# EAGLE design ps2_to_db9_double (EAGLE 9.6.2)
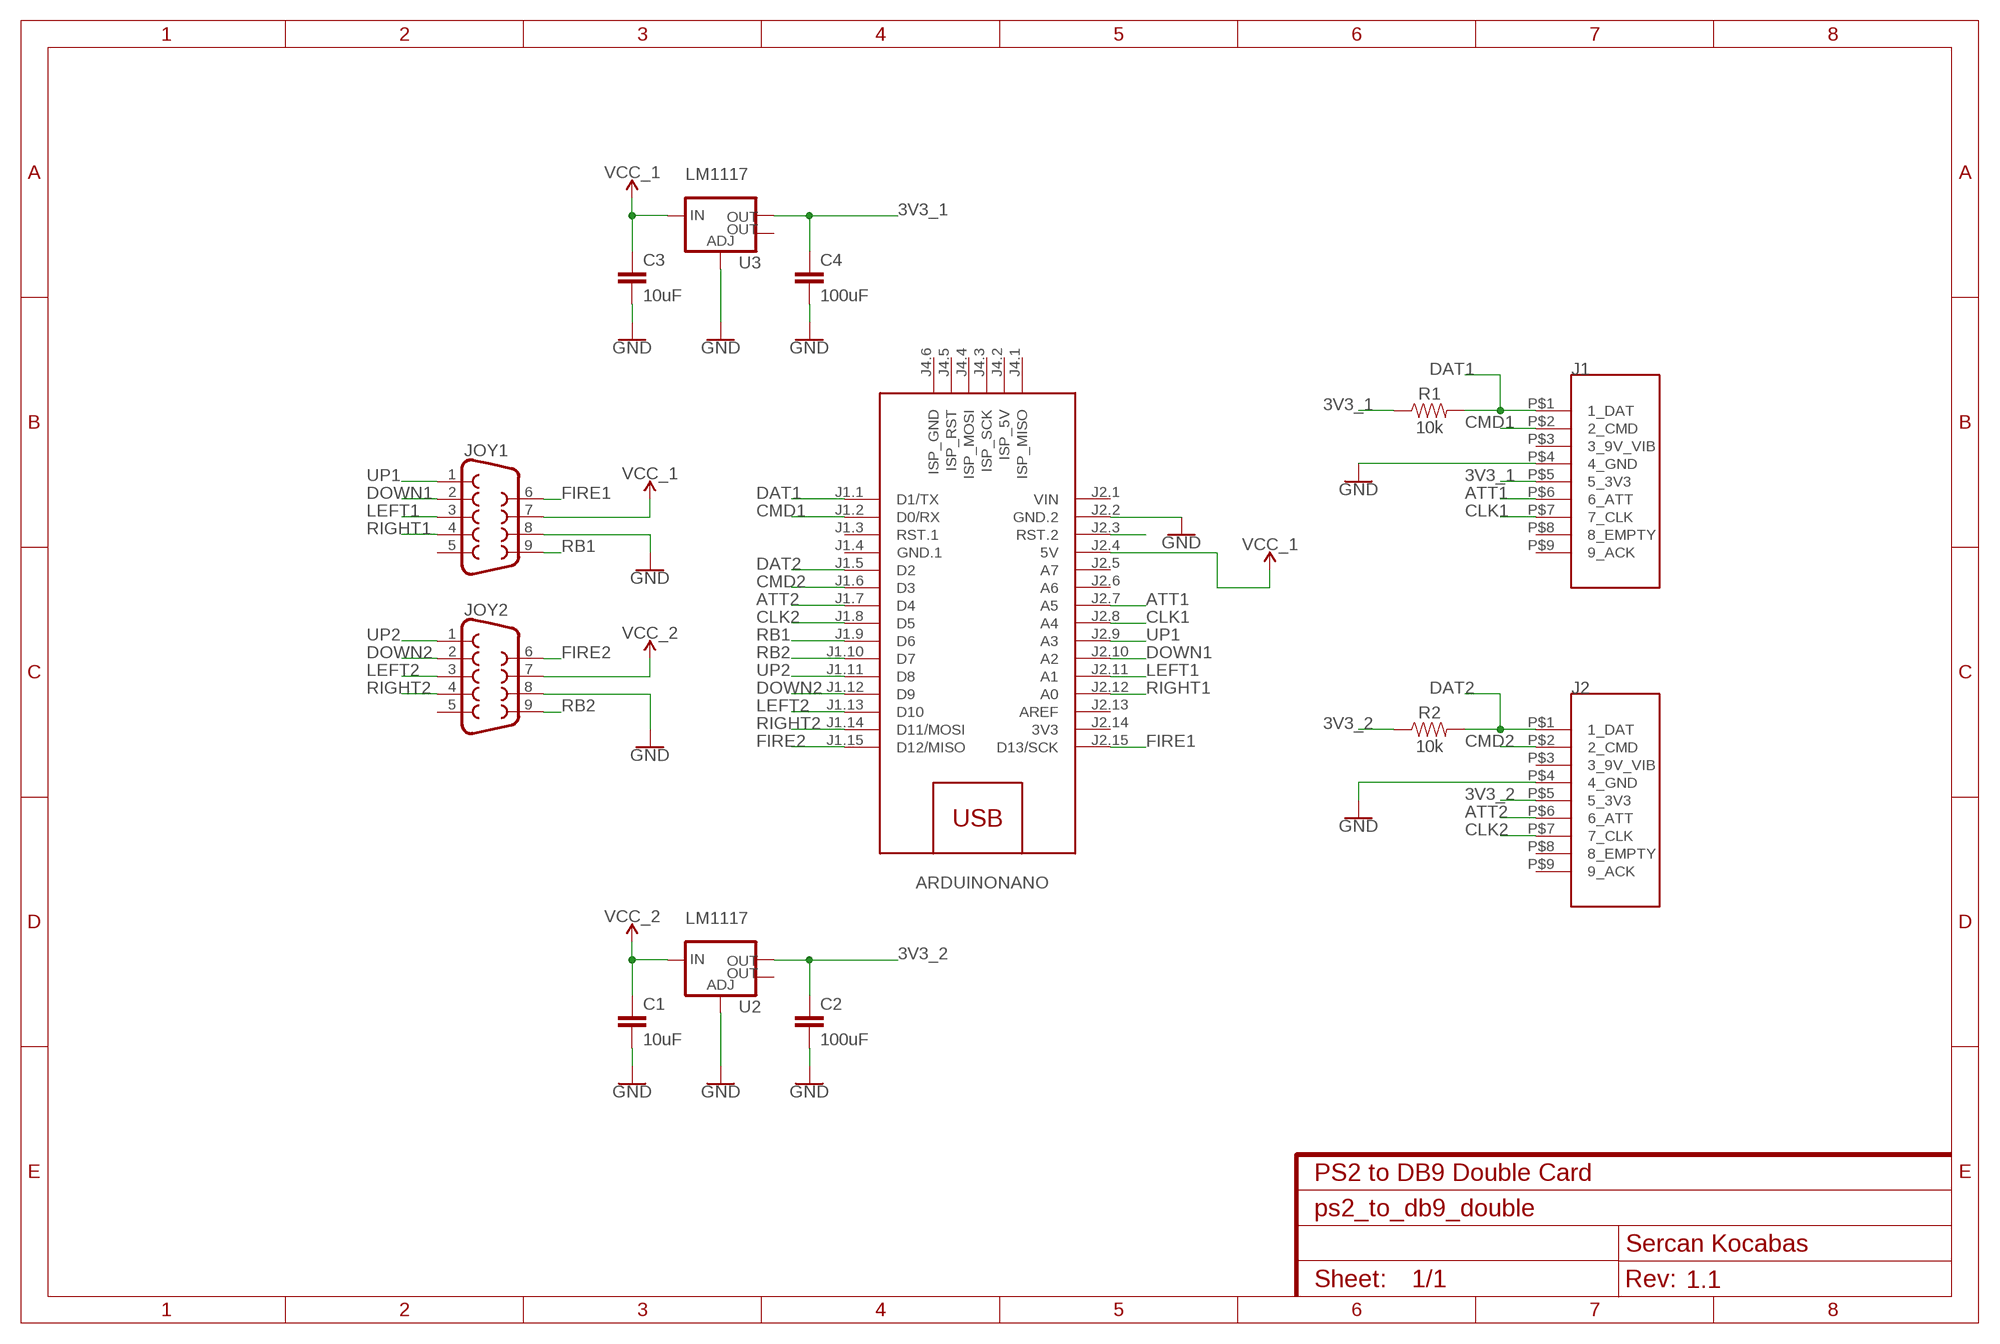
[diagram p0: schematic, sheet 1]
FRAME1 (FRAME-A4L): CNAME: PS2 to DB9 Double Card; CREVISION: 1.1; DESIGNER: Sercan Kocabas

## Parts
ARDUINONANO  ARDUINO-NANO-3.0#ISP  [ARDUINO-NANO-3.0#ISP]
C1  10uF  C-EU025-025X050  [C025-025X050]
C2  100uF  C-EU025-025X050  [C025-025X050]
C3  10uF  C-EU025-025X050  [C025-025X050]
C4  100uF  C-EU025-025X050  [C025-025X050]
J1  PS2_DUALSHOCK_UP  [PS2_DUALSHOCK_UP]
J2  PS2_DUALSHOCK_UP  [PS2_DUALSHOCK_UP]
JOY1  DB9FEMALE  [DB9]
JOY2  DB9FEMALE  [DB9]
R1  10k  10OHM-HORIZ-1/4W-1%  [AXIAL-0.3]
R2  10k  10OHM-HORIZ-1/4W-1%  [AXIAL-0.3]
U2  LM1117  V_REG_LM1117SOT223  [SOT223]
U3  LM1117  V_REG_LM1117SOT223  [SOT223]

## Nets
3V3_1: C4.1 J1.P$5(5_3V3) R1.P$1 U3.2(OUT)
3V3_2: C2.1 J2.P$5(5_3V3) R2.P$1 U2.2(OUT)
ATT1: ARDUINONANO.J2.7(A5) J1.P$6(6_ATT)
ATT2: ARDUINONANO.J1.7(D4) J2.P$6(6_ATT)
CLK1: ARDUINONANO.J2.8(A4) J1.P$7(7_CLK)
CLK2: ARDUINONANO.J1.8(D5) J2.P$7(7_CLK)
CMD1: ARDUINONANO.J1.2(D0/RX) J1.P$2(2_CMD)
CMD2: ARDUINONANO.J1.6(D3) J2.P$2(2_CMD)
DAT1: ARDUINONANO.J1.1(D1/TX) J1.P$1(1_DAT) R1.P$2
DAT2: ARDUINONANO.J1.5(D2) J2.P$1(1_DAT) R2.P$2
DOWN1: ARDUINONANO.J2.10(A2) JOY1.2
DOWN2: ARDUINONANO.J1.12(D9) JOY2.2
FIRE1: ARDUINONANO.J2.15(D13/SCK) JOY1.6
FIRE2: ARDUINONANO.J1.15(D12/MISO) JOY2.6
GND: ARDUINONANO.J2.2(GND.2) C1.2 C2.2 C3.2 C4.2 J1.P$4(4_GND) J2.P$4(4_GND) JOY1.8 JOY2.8 U2.1(ADJ) U3.1(ADJ)
LEFT1: ARDUINONANO.J2.11(A1) JOY1.3
LEFT2: ARDUINONANO.J1.13(D10) JOY2.3
N$24: ARDUINONANO.J2.3(RST.2)
RB1: ARDUINONANO.J1.9(D6) JOY1.9
RB2: ARDUINONANO.J1.10(D7) JOY2.9
RIGHT1: ARDUINONANO.J2.12(A0) JOY1.4
RIGHT2: ARDUINONANO.J1.14(D11/MOSI) JOY2.4
UP1: ARDUINONANO.J2.9(A3) JOY1.1
UP2: ARDUINONANO.J1.11(D8) JOY2.1
VCC_1: ARDUINONANO.J2.4(5V) C3.1 JOY1.7 U3.3(IN)
VCC_2: C1.1 JOY2.7 U2.3(IN)
Unconnected: ARDUINONANO.J1.3(RST.1) ARDUINONANO.J2.5(A7) ARDUINONANO.J2.6(A6) ARDUINONANO.J2.13(AREF) ARDUINONANO.J4.1(ISP_MISO) ARDUINONANO.J4.2(ISP_5V) ARDUINONANO.J4.3(ISP_SCK) ARDUINONANO.J4.4(ISP_MOSI) ARDUINONANO.J4.5(ISP_RST) ARDUINONANO.J4.6(ISP_GND) J1.P$3(3_9V_VIB) J1.P$8(8_EMPTY) J1.P$9(9_ACK) J2.P$3(3_9V_VIB) J2.P$8(8_EMPTY) J2.P$9(9_ACK) JOY1.5 JOY2.5 U2.4(OUT) U3.4(OUT)

## Power pins joined to a net without a drawn wire
3V3: ARDUINONANO.J2.14(3V3)
GND.1: ARDUINONANO.J1.4(GND.1)
VIN: ARDUINONANO.J2.1(VIN)

## Library data of the parts
ARDUINONANO = diy-modules:ARDUINO-NANO-3.0#ISP: Arduino Nano 3.0 (and compatible devices) with ISP pads More details available here: https://www.arduino.cc/en/Main/ArduinoBoardNano Click here to find device on ebay.com <http://www.ebay.com/sch/arduino+nano>
C1-C4 = rcl:C-EU: CAPACITOR, European symbol; SPICEPREFIX: C
J1 J2 = seco_lib:PS2_DUALSHOCK_UP
JOY1 JOY2 = SparkFun-Connectors:DB9: DB9 Connector Standard DB9 (D-Sub 9) serial connector. Can be used for CAN bus as well as RS485 and RS232. Footprint production proven. Here is the female version connector we sell at SparkFun: 9 Pin Female Serial Connector - PCB Mount <https://www.sparkfun.com/products/429> (PRT-00429) This connector has been used on the following SparkFun products: SparkFun RS232 Shifter - SMD <https://www.sparkfun.com/products/449> (PRT-00449) SparkFun RS232 Shifter SMD (No DB9) <https://www.sparkfun.com/products/8780> (PRT-08780); PROD_ID: CONN-08194
R1 R2 = SparkFun-Resistors:10OHM: 10Ω resistor A resistor is a passive two-terminal electrical component that implements electrical resistance as a circuit element. Resistors act to reduce current flow, and, at the same time, act to lower voltage levels within circuits. - Wikipedia; PROD_ID: RES-12180; VALUE: 10
U2 U3 = SparkFun-IC-Power:V_REG_LM1117: Voltage Regulator LM1117 Standard adjustable voltage regulator but in SMD form. Spark Fun Electronics SKU : COM-00595; PROD_ID: VREG-08170

## Board
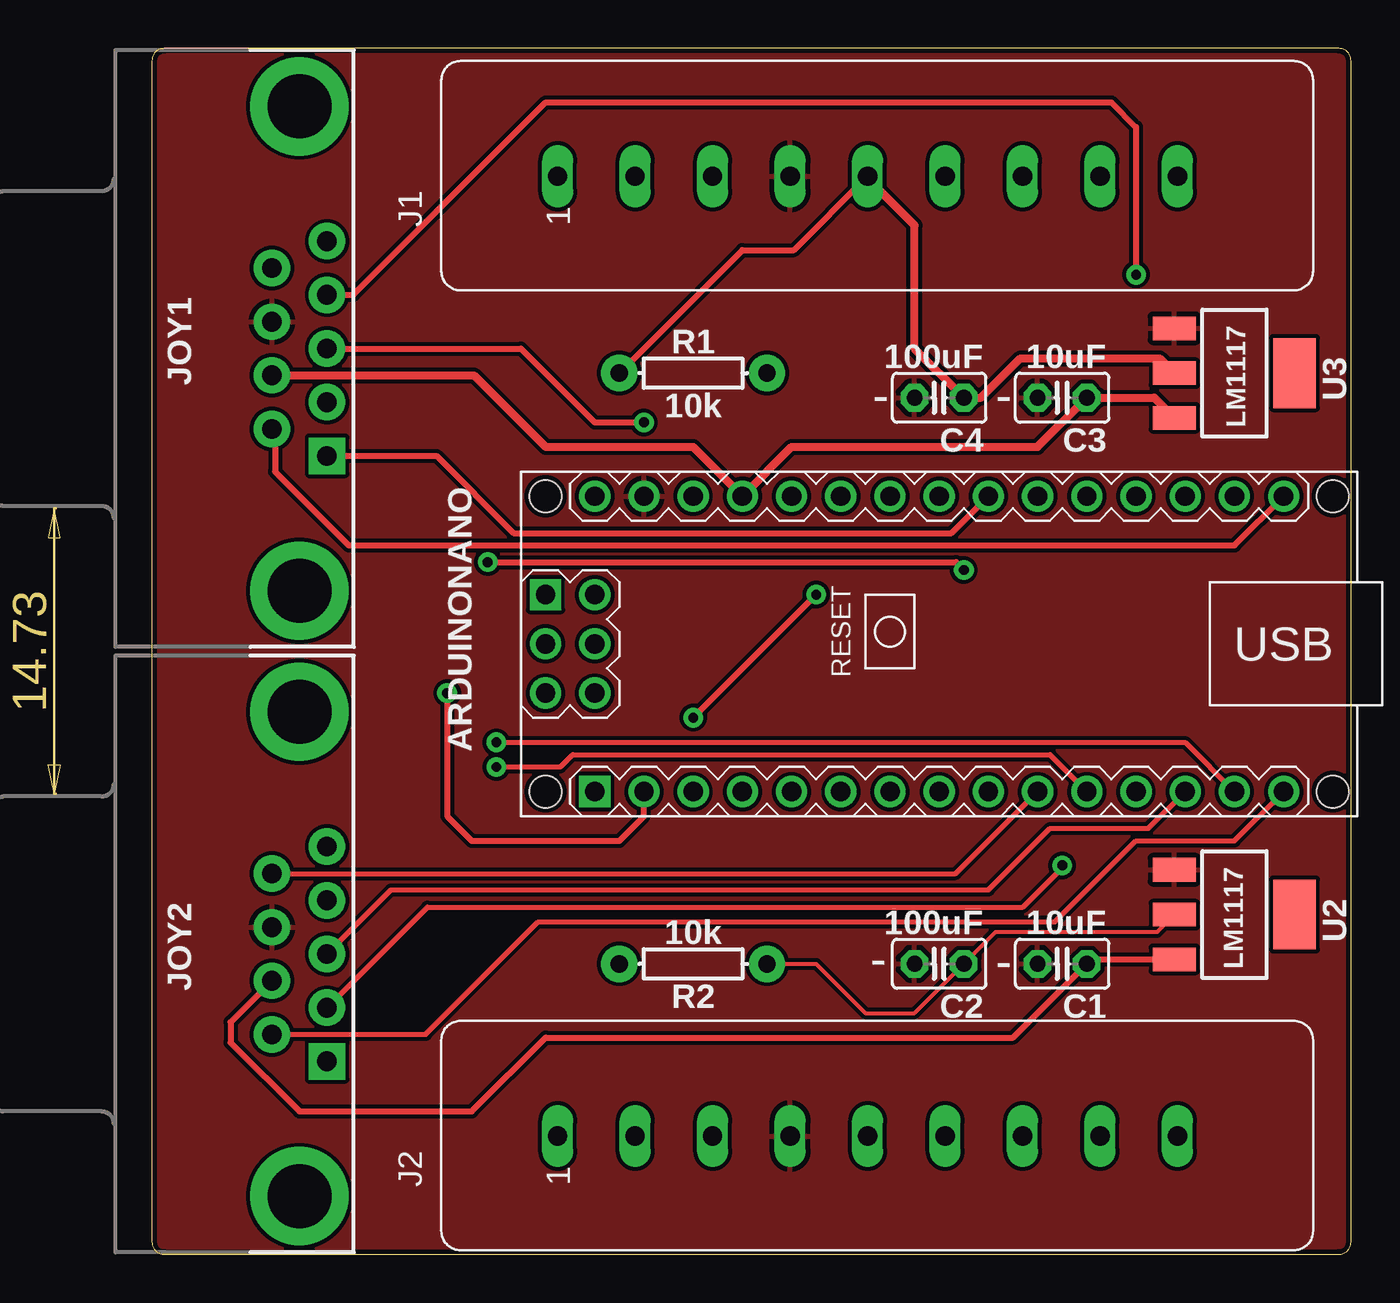
[diagram p1: board, top side]
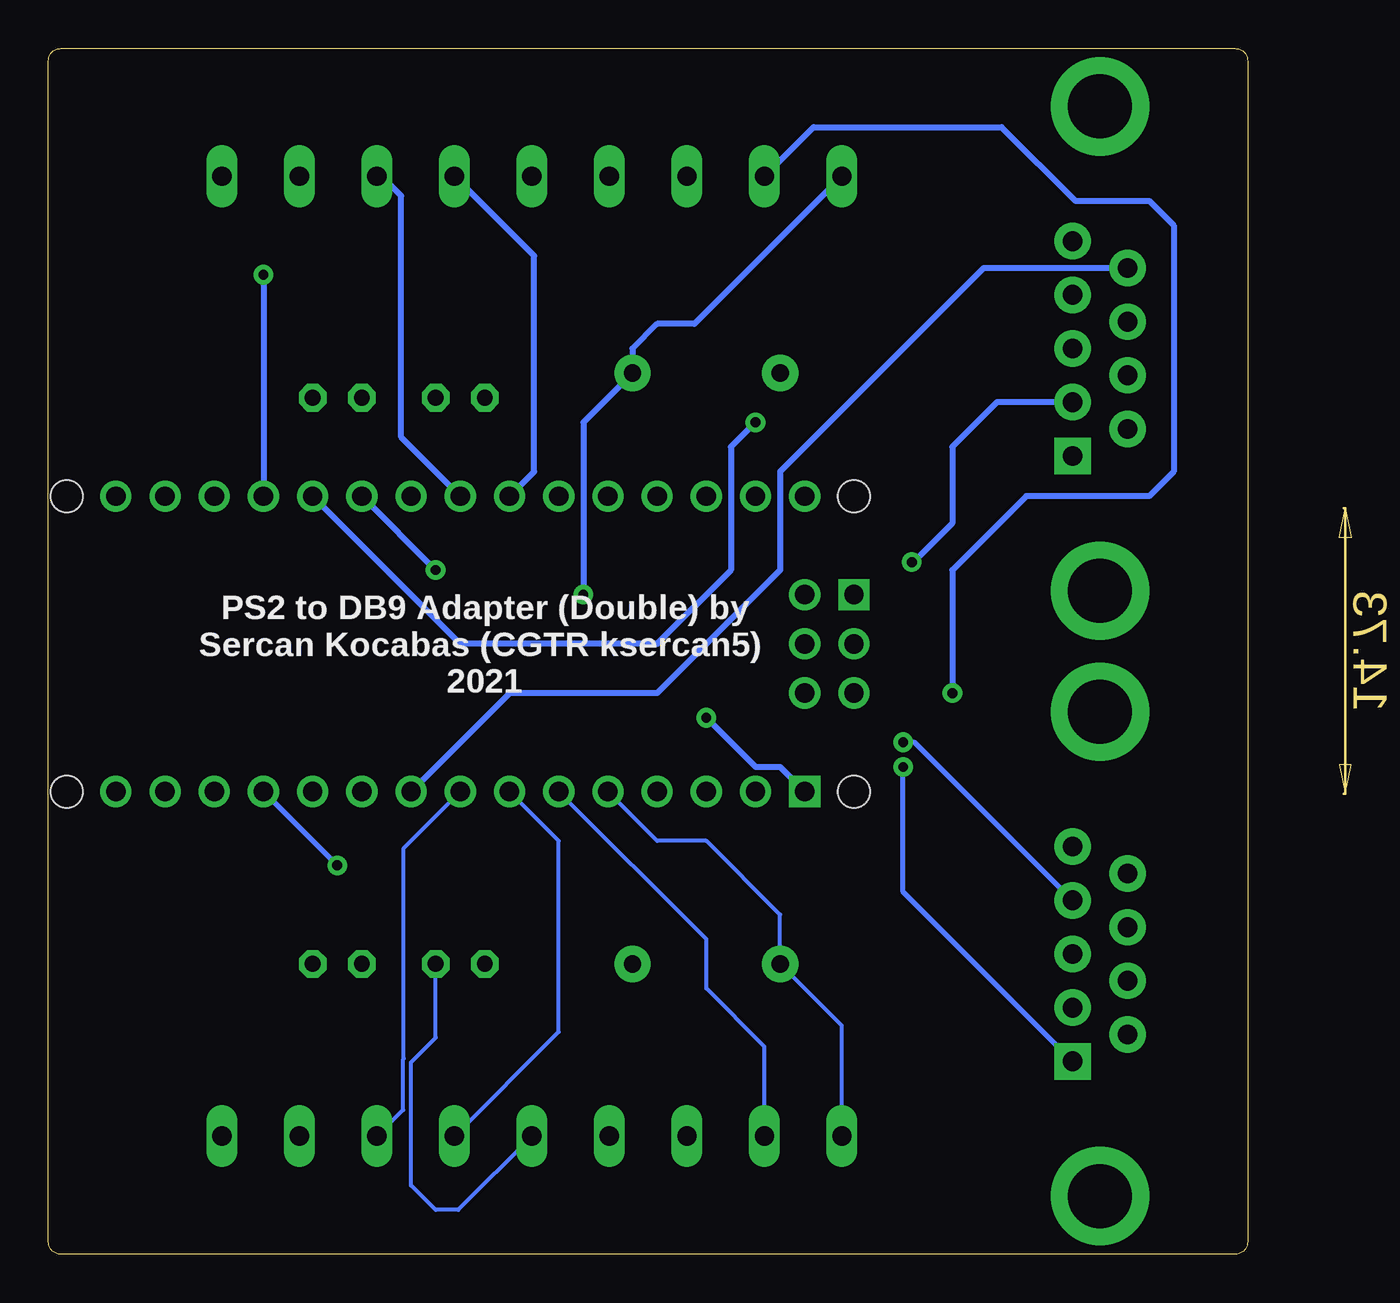
[diagram p2: board, bottom side, seen from below]

Size 61.9 x 62.22 mm. Coordinates in mm from the lower left corner, seen from the top.
Outline: 61.27,62.22 0.63,62.22 arc90 0,61.59 0,0.64 arc90 0.63,0 61.27,0 arc90 61.9,0.64 61.9,61.59 arc90 61.27,62.22
Copper layers (1*16): Top 0.035mm / dielectric 1.5mm / Bottom 0.035mm
Design rules "SparkFun": minimum track width 8mil, minimum drill 20mil, track to track 8mil, track to pad 8mil, pad to pad 8mil, via to via 8mil, smd to smd 8mil, copper to edge 10mil, drill to drill 8mil, minimum pad ring 12mil, minimum via ring 10mil, stop-mask expansion 4mil, vias tented up to drill 25mil, thermal gap 10mil

### Footprints (pad centres in the part's own frame; a part is rotated, then mirrored left to right if it is on the bottom)
ARDUINO-NANO-3.0#ISP = drill 1 square: J1.1 17.78,7.62; J4.1 20.32,-2.54 | drill 1: J1.2 15.24,7.62; J1.3 12.7,7.62; J1.4 10.16,7.62; J1.5 7.62,7.62; J1.6 5.08,7.62; J1.7 2.54,7.62; J1.8 0,7.62; J1.9 -2.54,7.62; J1.10 -5.08,7.62; J1.11 -7.62,7.62; J1.12 -10.16,7.62; J1.13 -12.7,7.62; J1.14 -15.24,7.62; J1.15 -17.78,7.62; J2.1 17.78,-7.62; J2.2 15.24,-7.62; J2.3 12.7,-7.62; J2.4 10.16,-7.62; J2.5 7.62,-7.62; J2.6 5.08,-7.62; J2.7 2.54,-7.62; J2.8 0,-7.62; J2.9 -2.54,-7.62; J2.10 -5.08,-7.62; J2.11 -7.62,-7.62; J2.12 -10.16,-7.62; J2.13 -12.7,-7.62; J2.14 -15.24,-7.62; J2.15 -17.78,-7.62; J4.2 17.78,-2.54; J4.3 20.32,0; J4.4 17.78,0; J4.5 20.32,2.54; J4.6 17.78,2.54 | hole 1.651: -20.32,7.62; -20.32,-7.62; 20.32,-7.62; 20.32,7.62
C025-025X050 = drill 0.813 octagon: 1 -1.27,0; 2 1.27,0
PS2_DUALSHOCK_UP = drill 1 long: P$1 0,7; P$2 0,3; P$3 0,-1; P$4 0,-5; P$5 0,-9; P$6 0,-13; P$7 0,-17; P$8 0,-21; P$9 0,-25
DB9 = drill 1.016 pad 1.88 square: 1 -5.54,-1.42 | drill 1.016 pad 1.88: 2 -2.77,-1.42; 3 0,-1.42; 4 2.77,-1.42; 5 5.54,-1.42; 6 -4.15,1.42; 7 -1.38,1.42; 8 1.38,1.42; 9 4.15,1.42 | drill 3.302 pad 5.08: G1 -12.5,0; G2 12.5,0
AXIAL-0.3 = drill 0.9 pad 1.88: P$1 -3.81,0; P$2 3.81,0
SOT223 = smd 1.219 x 2.235: 1 -2.311,-3.099; 2 0,-3.099; 3 2.311,-3.099 | smd 3.6 x 2.2: 4 0,3.099

### Placement (x,y rotation side)
ARDUINONANO  40.64,31.5 180 top
C1  46.99,14.99 180 top
C2  40.64,14.99 180 top
C3  46.99,44.2 180 top
C4  40.64,44.2 180 top
J1  27.94,55.63 90 top
J2  27.94,6.1 90 top
JOY1  7.62,46.74 90 top
JOY2  7.62,15.49 90 top
R1  27.94,45.47 0 top
R2  27.94,14.99 180 top
U2  55.88,17.53 270 top
U3  55.88,45.47 270 top

### Tracks (layer width: path | path; a pad name or v marks a point on that pad's centre or on a via)
3V3_1
  Top 0.305: R1.P$1 30.48,51.82 33.13,51.82 36.88,55.57 J1.P$5
  Top 0.406: U3.2 52.02,46.23 44.83,46.23 42.8,44.2 C4.1 39.37,46.74 39.37,53.09 36.88,55.57
3V3_2
  Top 0.203: R2.P$1 34.29,14.99 36.83,12.45 39.37,12.45 C2.1 43.56,16.64 51.89,16.64 U2.2
  Bottom 0.203: J2.P$5 40.75,2.29 41.91,2.29 43.18,3.56 43.18,9.91 41.91,11.18 C2.1
ATT1
  Bottom 0.305: ARDUINONANO.J2.7 36.83,40.39 36.83,51.52 J1.P$6
ATT2
  Bottom 0.203: J2.P$6 35.56,11.48 35.56,21.34 ARDUINONANO.J1.7
CLK1
  Bottom 0.305: ARDUINONANO.J2.8 43.69,42.16 43.69,54.61 44.7,55.63 J1.P$7
CLK2
  Bottom 0.203: J2.P$7 43.59,7.45 43.59,10.07 43.56,10.1 43.56,20.96 ARDUINONANO.J1.8
CMD1  (via drill 0.51)
  Top 0.305: v15.24,28.96 15.24,22.61 16.51,21.34 24.13,21.34 25.4,22.61 ARDUINONANO.J1.2
  Bottom 0.305: J1.P$2 22.4,58.17 12.7,58.17 8.89,54.36 5.08,54.36 3.81,53.09 3.81,40.39 5.08,39.12 11.43,39.12 15.24,35.31 v15.24,28.96
CMD2
  Bottom 0.203: J2.P$2 24.94,10.72 27.94,13.72 27.94,16.26 ARDUINONANO.J1.6
DAT1  (via drill 0.51)
  Top 0.305: v34.29,34.04 v27.94,27.69
  Bottom 0.305: J1.P$1 28.56,48.01 30.48,48.01 31.75,46.74 R1.P$2 34.29,42.93 v34.29,34.04 | v27.94,27.69 25.4,25.15 24.13,25.15 ARDUINONANO.J1.1
DAT2
  Bottom 0.203: ARDUINONANO.J1.5 30.48,21.34 27.94,21.34 24.13,17.53 R2.P$2 20.94,11.8 J2.P$1
DOWN1  (via drill 0.51)
  Top 0.305: v17.34,35.71 41.5,35.71 v41.91,35.31
  Bottom 0.305: JOY1.2 12.93,43.97 15.24,41.66 15.24,37.72 17.27,35.69 17.31,35.69 v17.34,35.71 | v41.91,35.31 ARDUINONANO.J2.10
DOWN2  (via drill 0.51)
  Top 0.254: JOY2.2 14.22,17.91 44.96,17.91 46.99,19.94 v46.99,20.07
  Bottom 0.254: v46.99,20.07 ARDUINONANO.J1.12
FIRE1
  Top 0.305: JOY1.6 6.35,42.44 6.35,40.39 10.16,36.58 55.88,36.58 ARDUINONANO.J2.15
FIRE2
  Top 0.254: JOY2.6 14.14,11.34 19.94,17.15 46.61,17.15 50.8,21.34 55.88,21.34 ARDUINONANO.J1.15
GND
  pour Top: -10.16,64.52 -10.16,-2.79 67.31,-2.79 67.31,65.79 -10.16,65.79
LEFT1  (via drill 0.51)
  Top 0.305: JOY1.3 19.05,46.74 22.86,42.93 v25.4,42.93
  Bottom 0.305: v25.4,42.93 26.67,41.66 26.67,35.31 30.48,31.5 40.64,31.5 ARDUINONANO.J2.11
LEFT2
  Top 0.254: JOY2.3 12.34,18.8 43.18,18.8 46.36,21.97 51.44,21.97 ARDUINONANO.J1.13
RB1
  Bottom 0.305: JOY1.9 13.63,50.89 24.13,40.39 24.13,35.31 30.48,28.96 38.1,28.96 ARDUINONANO.J1.9
RB2
  Top 0.254: JOY2.9 41.49,19.64 ARDUINONANO.J1.10
RIGHT1  (via drill 0.51)
  Top 0.305: JOY1.4 10.39,49.51 20.32,59.44 49.53,59.44 50.8,58.17 v50.8,50.55
  Bottom 0.305: v50.8,50.55 ARDUINONANO.J2.12
RIGHT2  (via drill 0.51)
  Top 0.254: v17.78,26.42 53.34,26.42 ARDUINONANO.J1.14
  Bottom 0.254: JOY2.4 17.19,26.42 v17.78,26.42
UP1
  Top 0.305: JOY1.1 14.68,41.2 18.67,37.21 41.27,37.21 ARDUINONANO.J2.9
UP2  (via drill 0.51)
  Top 0.254: ARDUINONANO.J1.11 46.36,25.78 21.72,25.78 21.08,25.15 v17.78,25.15
  Bottom 0.254: JOY2.1 17.78,18.69 v17.78,25.15
VCC_1
  Top 0.406: U3.3 51.74,44.2 C3.1 45.72,41.66 33.02,41.66 ARDUINONANO.J2.4 27.94,41.66 20.32,41.66 16.62,45.36 JOY1.7
VCC_2
  Top 0.305: JOY2.7 4.06,11.98 4.06,10.92 7.62,7.37 16.51,7.37 20.32,11.18 44.45,11.18 C1.1 48.49,15.22 U2.3

### Text on the board
tPlace: - | - | - | -
bPlace: PS2 to DB9 Adapter (Double) by / Sercan Kocabas (CGTR ksercan5) / 2021